# Altium project Altium.PrjPcb
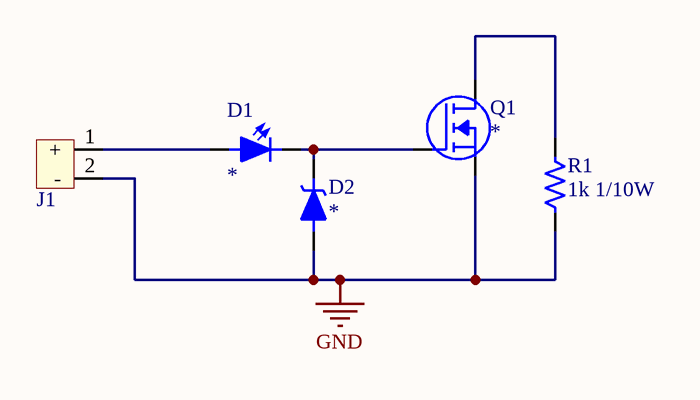
[diagram p0: mcu.SchDoc]
1 sheet, 5 parts. Net scope: global (net labels, ports and power ports of the same name join across sheets).
Board file: board.PcbDoc

## Sheet mcu.SchDoc
size A; SheetNumber: 1; SheetTotal: 1; SPICEModelCacheEPVQDKTF: <root> / <DocumentId>EPVQDKTF</DocumentId> / </root>

### Parts
D1  LED  [LED_0603 IPC-A]  (value not drawn)
D2  Zener diode  [SOD-323 IPC-C]  (value not drawn)
J1  2x1 Header  [2.54mm_1mm_1x2]  (value not drawn)
Q1  E-MOSFET N  [SOT-23 IPC-C]  (value not drawn)
R1  value 1k 1/10W  [RES_0805 IPC-C]  (hidden comment: Resistor)

### Nets
GND: D2.1(A) J1.2(-) Q1.2(S) R1.1
NetD1_1: D1.1(A) J1.1(+)
NetD1_2: D1.2(K) D2.2(K) Q1.1(G)
NetQ1_3: Q1.3(D) R1.2

### Library data of the parts
D1 = LED: Manufacturer: *; Manufacturer part number: *; Value: *
D2 = Zener diode: Manufacturer: *; Manufacturer part number: *; Value: *
J1 = 2x1 Header: Manufacturer: *; Package: *; Value: *
Q1 = E-MOSFET N: Manufacturer: *; Manufacturer part number: *; Value: *
R1 = Resistor: Package Reference: *; Manufacturer: *